# EAGLE design PRY397 (EAGLE 9.4.2)
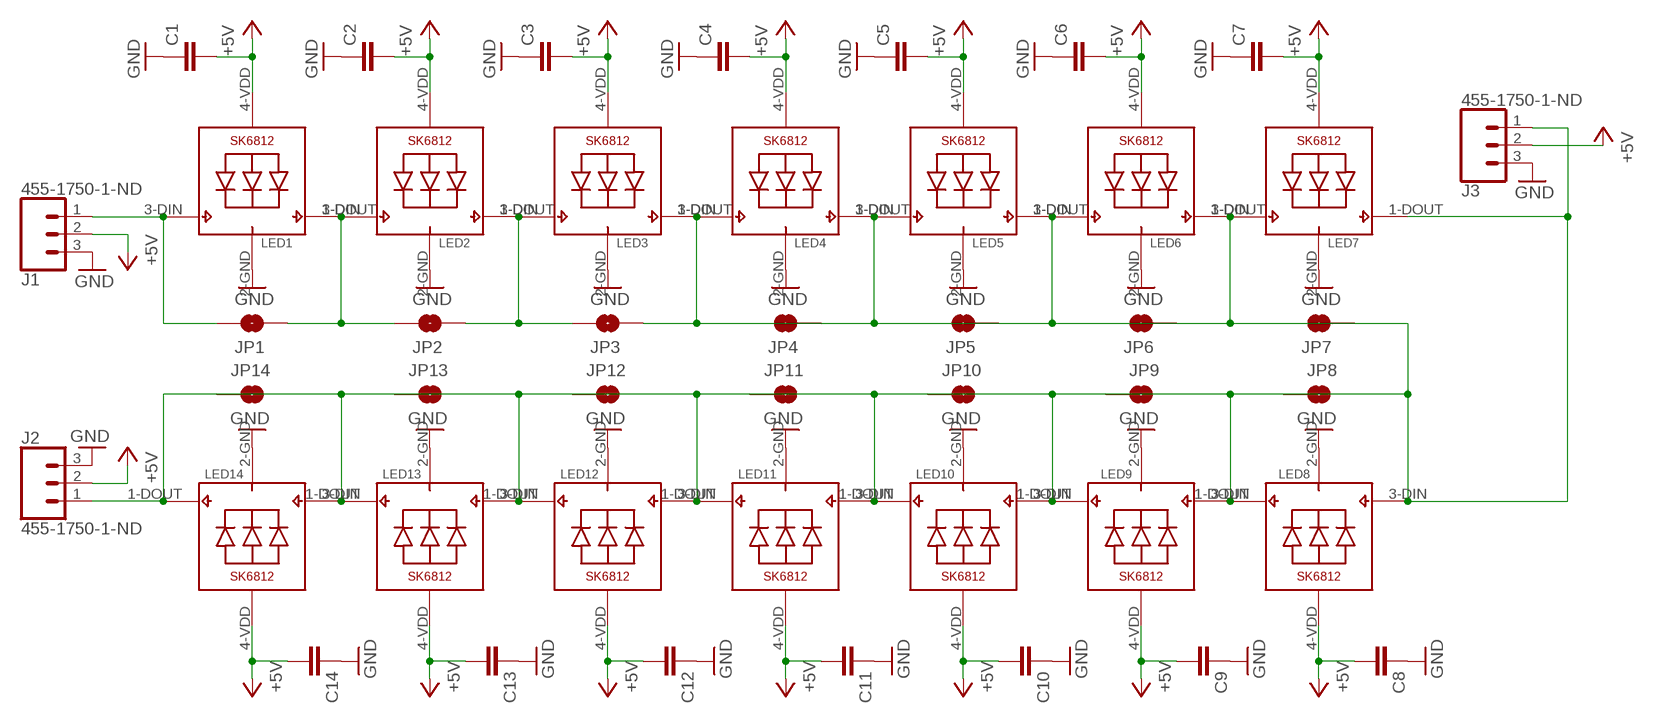
[diagram p0: schematic, sheet 1]

## Parts
C1  C-EUC1206  [C1206]
C2  C-EUC1206  [C1206]
C3  C-EUC1206  [C1206]
C4  C-EUC1206  [C1206]
C5  C-EUC1206  [C1206]
C6  C-EUC1206  [C1206]
C7  C-EUC1206  [C1206]
C8  C-EUC1206  [C1206]
C9  C-EUC1206  [C1206]
C10  C-EUC1206  [C1206]
C11  C-EUC1206  [C1206]
C12  C-EUC1206  [C1206]
C13  C-EUC1206  [C1206]
C14  C-EUC1206  [C1206]
J1  455-1750-1-ND  CONN_03  [1X03]
J2  455-1750-1-ND  CONN_03  [1X03]
J3  455-1750-1-ND  CONN_03LONGPADS  [1X03_LONGPADS]
JP1  JUMPER-SMT_2_NO_SILK  [SMT-JUMPER_2_NO_SILK]
JP2  JUMPER-SMT_2_NO_SILK  [SMT-JUMPER_2_NO_SILK]
JP3  JUMPER-SMT_2_NO_SILK  [SMT-JUMPER_2_NO_SILK]
JP4  JUMPER-SMT_2_NO_SILK  [SMT-JUMPER_2_NO_SILK]
JP5  JUMPER-SMT_2_NO_SILK  [SMT-JUMPER_2_NO_SILK]
JP6  JUMPER-SMT_2_NO_SILK  [SMT-JUMPER_2_NO_SILK]
JP7  JUMPER-SMT_2_NO_SILK  [SMT-JUMPER_2_NO_SILK]
JP8  JUMPER-SMT_2_NO_SILK  [SMT-JUMPER_2_NO_SILK]
JP9  JUMPER-SMT_2_NO_SILK  [SMT-JUMPER_2_NO_SILK]
JP10  JUMPER-SMT_2_NO_SILK  [SMT-JUMPER_2_NO_SILK]
JP11  JUMPER-SMT_2_NO_SILK  [SMT-JUMPER_2_NO_SILK]
JP12  JUMPER-SMT_2_NO_SILK  [SMT-JUMPER_2_NO_SILK]
JP13  JUMPER-SMT_2_NO_SILK  [SMT-JUMPER_2_NO_SILK]
JP14  JUMPER-SMT_2_NO_SILK  [SMT-JUMPER_2_NO_SILK]
LED1  SK6812_3535  [LED3535]
LED2  SK6812_3535  [LED3535]
LED3  SK6812_3535  [LED3535]
LED4  SK6812_3535  [LED3535]
LED5  SK6812_3535  [LED3535]
LED6  SK6812_3535  [LED3535]
LED7  SK6812_3535  [LED3535]
LED8  SK6812_3535  [LED3535]
LED9  SK6812_3535  [LED3535]
LED10  SK6812_3535  [LED3535]
LED11  SK6812_3535  [LED3535]
LED12  SK6812_3535  [LED3535]
LED13  SK6812_3535  [LED3535]
LED14  SK6812_3535  [LED3535]

## Nets
+5V: C1.2 C2.2 C3.2 C4.2 C5.2 C6.2 C7.2 C8.2 C9.2 C10.2 C11.2 C12.2 C13.2 C14.2 J1.2 J2.2 J3.2 LED1.4-VDD(VDD) LED2.4-VDD(VDD) LED3.4-VDD(VDD) LED4.4-VDD(VDD) LED5.4-VDD(VDD) LED6.4-VDD(VDD) LED7.4-VDD(VDD) LED8.4-VDD(VDD) LED9.4-VDD(VDD) LED10.4-VDD(VDD) LED11.4-VDD(VDD) LED12.4-VDD(VDD) LED13.4-VDD(VDD) LED14.4-VDD(VDD)
GND: C1.1 C2.1 C3.1 C4.1 C5.1 C6.1 C7.1 C8.1 C9.1 C10.1 C11.1 C12.1 C13.1 C14.1 J1.3 J2.3 J3.3 LED1.2-GND(GND) LED2.2-GND(GND) LED3.2-GND(GND) LED4.2-GND(GND) LED5.2-GND(GND) LED6.2-GND(GND) LED7.2-GND(GND) LED8.2-GND(GND) LED9.2-GND(GND) LED10.2-GND(GND) LED11.2-GND(GND) LED12.2-GND(GND) LED13.2-GND(GND) LED14.2-GND(GND)
N$1: JP1.2 JP2.1 LED1.1-DOUT(DO) LED2.3-DIN(DI)
N$2: JP2.2 JP3.1 LED2.1-DOUT(DO) LED3.3-DIN(DI)
N$3: JP3.2 JP4.2 LED3.1-DOUT(DO) LED4.3-DIN(DI)
N$4: JP4.1 JP5.2 LED4.1-DOUT(DO) LED5.3-DIN(DI)
N$5: JP5.1 JP6.2 LED5.1-DOUT(DO) LED6.3-DIN(DI)
N$6: JP6.1 JP7.2 LED6.1-DOUT(DO) LED7.3-DIN(DI)
N$7: JP8.1 JP9.2 LED8.1-DOUT(DO) LED9.3-DIN(DI)
N$8: JP9.1 JP10.2 LED9.1-DOUT(DO) LED10.3-DIN(DI)
N$9: JP10.1 JP11.2 LED10.1-DOUT(DO) LED11.3-DIN(DI)
N$10: JP11.1 JP12.2 LED11.1-DOUT(DO) LED12.3-DIN(DI)
N$11: JP12.1 JP13.2 LED12.1-DOUT(DO) LED13.3-DIN(DI)
N$12: JP13.1 JP14.2 LED13.1-DOUT(DO) LED14.3-DIN(DI)
N$13: J3.1 JP7.1 JP8.2 LED7.1-DOUT(DO) LED8.3-DIN(DI)
N$14: J1.1 JP1.1 LED1.3-DIN(DI)
N$15: J2.1 JP14.1 LED14.1-DOUT(DO)

## Library data of the parts
C1-C14 = rcl:C-EU: CAPACITOR, European symbol; SPICEPREFIX: C
J1 J2 = SparkFun-Connectors:CONN_03: Multi connection point. Often used as Generic Header-pin footprint for 0.1 inch spaced/style header connections On any of the 0.1 inch spaced packages, you can populate with these: Break Away Headers - Straight <https://www.sparkfun.com/products/116> (PRT-00116) Break Away Male Headers - Right Angle <https://www.sparkfun.com/products/553> (PRT-00553) Female Headers <https://www.sparkfun.com/products/115> (PRT-00115) Break Away Headers - Machine Pin <https://www.sparkfun.com/products/117> (PRT-00117) Break Away Female Headers - Swiss Machine Pin <https://www.sparkfun.com/products/743> (PRT-00743) Stackable Header - 3 Pin (Female, 0.1") <https://www.sparkfun.com/products/13875> (PRT-13875) For SCREWTERMINALS and SPRING TERMINALS visit here: Screw Terimnals on SparkFun.com <https://www.sparkfun.com/search/results?term=Screw+Terminals> (5mm/3.5mm/2.54mm spacing) This device is also useful as a general connection point to wire up your design to another part of your project. Our various solder wires solder well into these plated through hole pads. Hook-Up Wire - Assortment (Stranded, 22 AWG) <https://www.sparkfun.com/products/11375> (PRT-11375) Hook-Up Wire - Assortment (Solid Core, 22 AWG) <https://www.sparkfun.com/products/11367> (PRT-11367) View the entire wire category on our website here <https://www.sparkfun.com/categories/141> Special notes: Molex polarized connector foot print use with SKU : PRT-08232 with associated crimp pins and housings.; PROD_ID: XXX-00000
J3 = SparkFun-Connectors:CONN_03: Multi connection point. Often used as Generic Header-pin footprint for 0.1 inch spaced/style header connections On any of the 0.1 inch spaced packages, you can populate with these: Break Away Headers - Straight <https://www.sparkfun.com/products/116> (PRT-00116) Break Away Male Headers - Right Angle <https://www.sparkfun.com/products/553> (PRT-00553) Female Headers <https://www.sparkfun.com/products/115> (PRT-00115) Break Away Headers - Machine Pin <https://www.sparkfun.com/products/117> (PRT-00117) Break Away Female Headers - Swiss Machine Pin <https://www.sparkfun.com/products/743> (PRT-00743) Stackable Header - 3 Pin (Female, 0.1") <https://www.sparkfun.com/products/13875> (PRT-13875) For SCREWTERMINALS and SPRING TERMINALS visit here: Screw Terimnals on SparkFun.com <https://www.sparkfun.com/search/results?term=Screw+Terminals> (5mm/3.5mm/2.54mm spacing) This device is also useful as a general connection point to wire up your design to another part of your project. Our various solder wires solder well into these plated through hole pads. Hook-Up Wire - Assortment (Stranded, 22 AWG) <https://www.sparkfun.com/products/11375> (PRT-11375) Hook-Up Wire - Assortment (Solid Core, 22 AWG) <https://www.sparkfun.com/products/11367> (PRT-11367) View the entire wire category on our website here <https://www.sparkfun.com/categories/141> Special notes: Molex polarized connector foot print use with SKU : PRT-08232 with associated crimp pins and housings.
JP1-JP14 = SparkFun-Jumpers:JUMPER-SMT_2_NO: Normally open jumper This jumper has two pads in close proximity to each other. Apply solder to close the connection. Round pads are easier to solder for beginners, but are a lot larger. SparkFun Product that uses the round pads: SparkFun EL Sequencer <https://www.sparkfun.com/products/12781>
LED1-LED14 = SK6812:SK6812

## Board
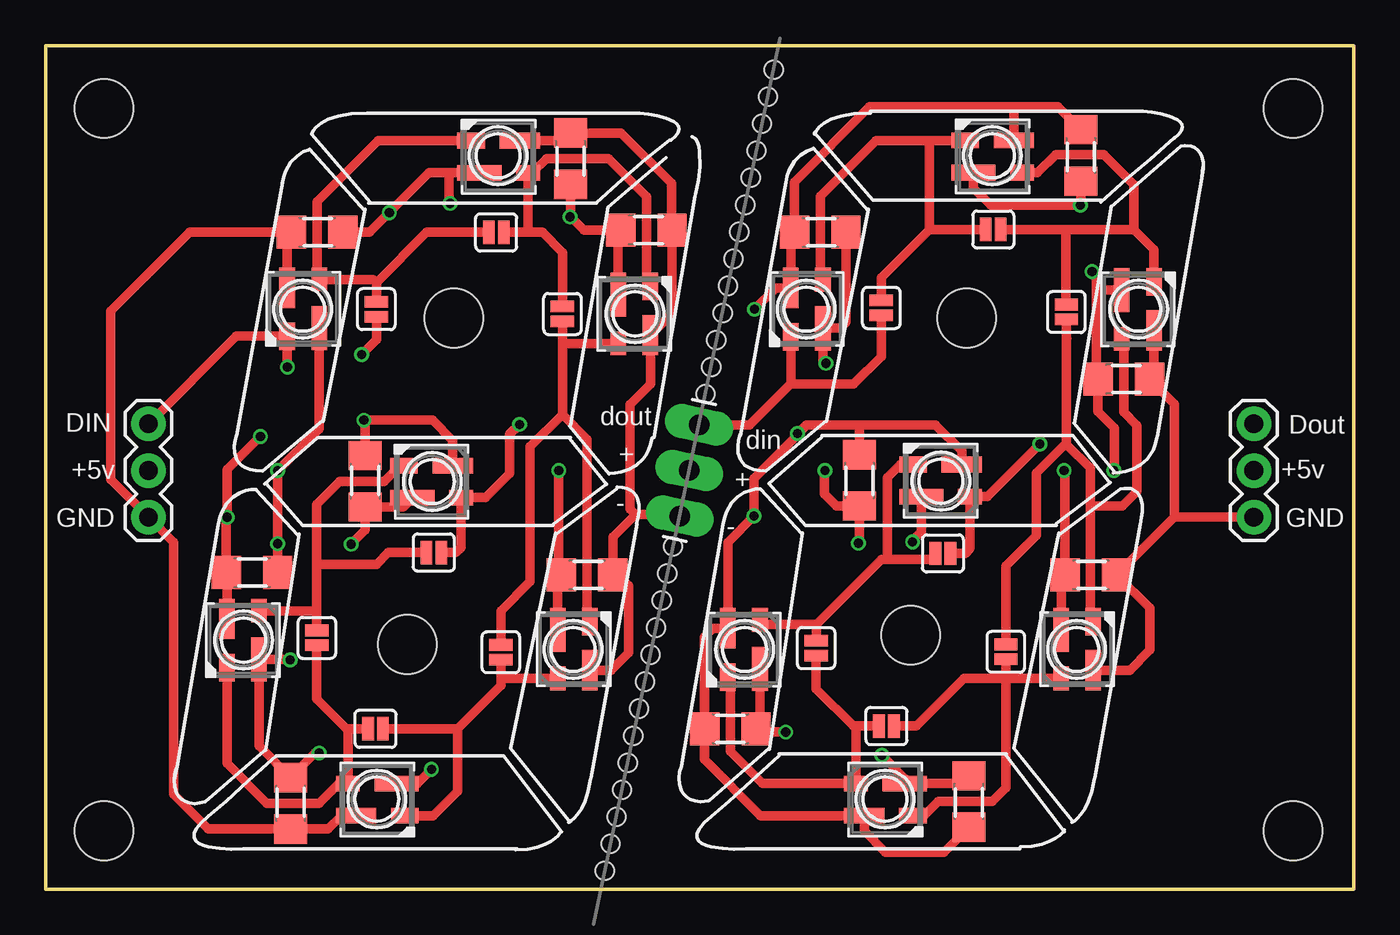
[diagram p1: board, top side]
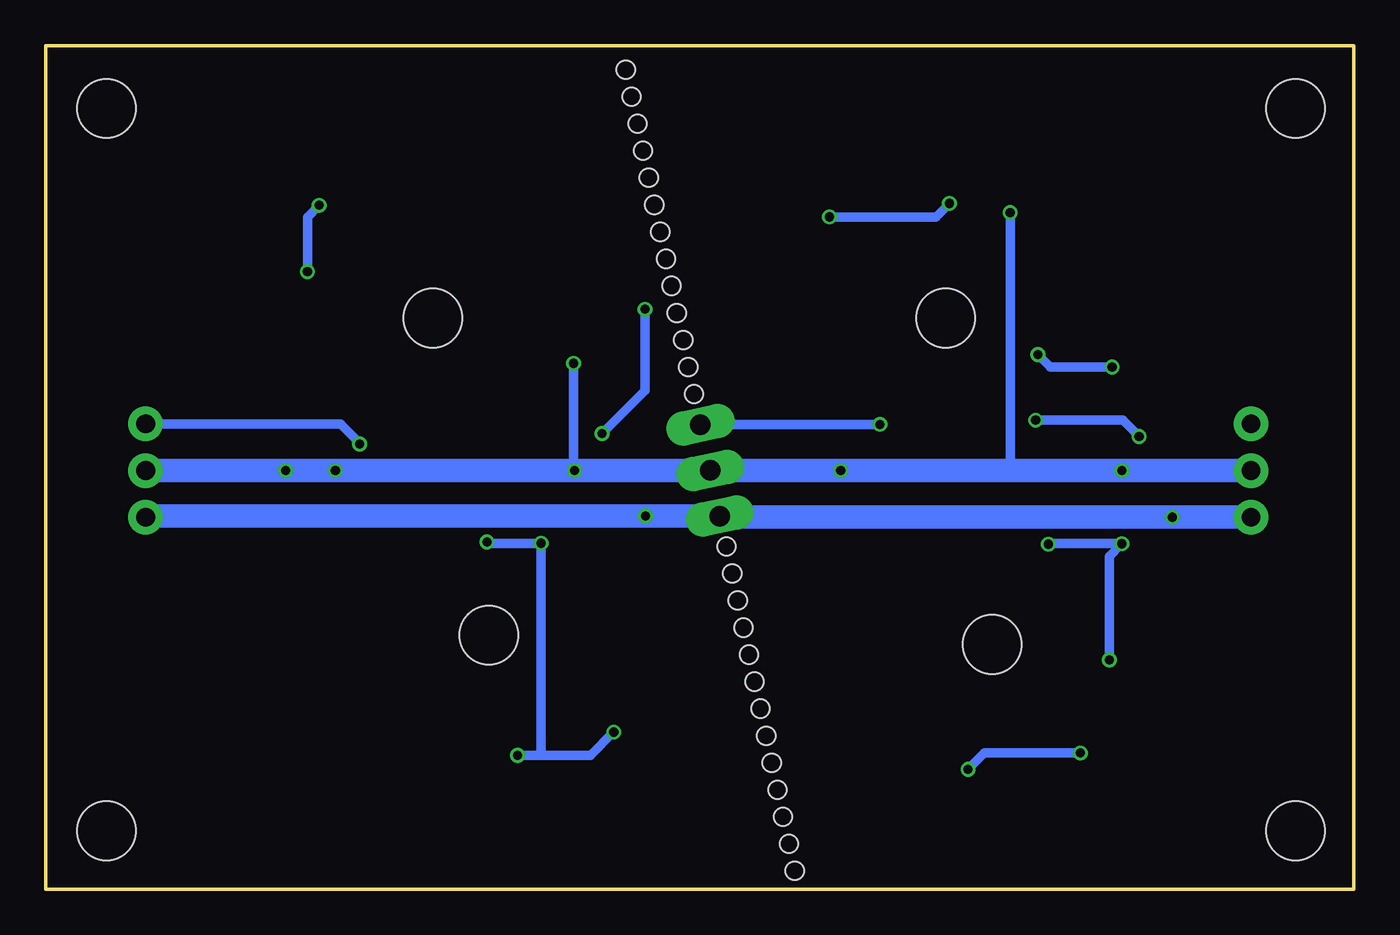
[diagram p2: board, bottom side, seen from below]

Size 71.25 x 45.95 mm. Coordinates in mm from the lower left corner, seen from the top.
Outline: 0,0 71.25,0 71.25,45.95 0,45.95 0,0
Copper layers (1*16): Top 0.035mm / dielectric 1.5mm / Bottom 0.035mm
Design rules "_xircuitos.mx_2L_DRC": minimum track width 6mil, minimum drill 12mil, track to track 6mil, track to pad 6mil, pad to pad 6mil, via to via 6mil, smd to smd 0mil, copper to edge 10mil, drill to drill 12mil, minimum pad ring 10mil, minimum via ring 6mil, stop-mask expansion 2mil, vias tented up to drill 100mil, thermal gap 10mil
Holes 3.2 mm at 3.17,42.55 67.94,42.55 67.94,3.17 3.17,3.17 22.23,31.11 19.68,13.34 47.12,13.84 50.16,31.11
Holes 1 mm at 34.16,18.67 33.86,17.2 33.55,15.72 33.25,14.25 32.94,12.78 32.64,11.3 32.31,9.83 32,8.36 31.7,6.88 31.39,5.41 31.09,3.94 30.76,2.46 30.45,0.99 35.94,26.97 36.25,28.45 36.53,29.92 36.88,31.39 37.16,32.87 37.47,34.34 37.77,35.81 38.1,37.29 38.4,38.76 38.71,40.23 39.01,41.71 39.34,43.18 39.65,44.65

### Footprints (pad centres in the part's own frame; a part is rotated, then mirrored left to right if it is on the bottom)
C1206 = smd 1.6 x 1.8: 1 -1.4,0; 2 1.4,0
1X03 = drill 1.016 pad 1.88: 1 0,0; 2 2.54,0; 3 5.08,0
1X03_LONGPADS = drill 1.118 pad 1.88 long: 1 0,0; 2 2.54,0; 3 5.08,0
SMT-JUMPER_2_NO_SILK = smd 0.635 x 1.27: 1 -0.406,0; 2 0.406,0
LED3535 = smd 1.3 x 0.85: 1-DOUT 1.6,-0.875 | smd 2.2 x 0.85: 2-GND 1.15,0.875 | smd 1.5 x 0.85: 3-DIN -1.5,0.875 | smd 2.4 x 0.85: 4-VDD -1.05,-0.875

### Placement (x,y rotation side)
C1  14.78,35.79 0 top
C2  28.57,39.8 270 top
C3  32.72,35.92 180 top
C4  29.49,17.12 180 top
C5  13.34,4.67 90 top
C6  11.23,17.25 0 top
C7  17.4,22.23 270 top
C8  42.19,35.79 0 top
C9  56.39,39.98 270 top
C10  58.72,27.79 180 top
C11  56.92,17.12 180 top
C12  50.29,4.78 90 top
C13  37.29,8.74 0 top
C14  44.32,22.28 270 top
J1  5.59,25.35 270 top
J2  65.81,25.35 270 top
J3  35.59,25.3 258 top
JP1  18.01,31.6 90 top
JP2  24.54,35.79 0 top
JP3  28.14,31.34 270 top
JP4  24.79,12.9 90 top
JP5  17.96,8.74 0 top
JP6  14.76,13.69 270 top
JP7  21.13,18.34 180 top
JP8  45.52,31.67 270 top
JP9  51.61,35.94 180 top
JP10  55.6,31.45 90 top
JP11  52.3,12.93 90 top
JP12  45.8,8.89 0 top
JP13  41.96,13.13 270 top
JP14  48.87,18.29 180 top
LED1  14.02,31.62 90 top
LED2  24.67,39.91 0 top
LED3  32.06,31.34 270 top
LED4  28.76,13.08 270 top
LED5  18.05,4.87 180 top
LED6  10.74,13.57 90 top
LED7  21.01,22.2 0 top
LED8  41.46,31.61 90 top
LED9  51.59,39.92 0 top
LED10  59.49,31.59 270 top
LED11  56.19,13.08 270 top
LED12  45.74,4.88 180 top
LED13  38.03,13.06 90 top
LED14  48.75,22.26 0 top

### Tracks (layer width: path | path; a pad name or v marks a point on that pad's centre or on a via)
+5V  (via drill 0.5)
  Top 0.508: C6.2 v12.63,18.82 12.63,20.83 | 12.63,20.83 v12.63,22.81 | v12.63,22.81 v12.62,22.81 | 12.63,20.82 12.63,20.83 | LED4.4-VDD 27.88,16.91 C4.2 27.94,17.27 v27.94,22.81 | v55.47,22.81 55.52,22.77 C11.2 55.31,16.91 LED11.4-VDD | C12.2 49.87,5.76 LED12.4-VDD 46.79,6.04 v45.54,7.29 | LED1.4-VDD 14.89,25.07 v12.63,22.81 | LED7.4-VDD 19.46,20.82 C7.2 17.4,19.56 v16.64,18.8 | 21.97,39.03 20.87,39.03 v18.71,36.87 17.63,35.79 C1.2 | 21.97,39.03 LED2.4-VDD | 28.83,38.4 C2.2 28.57,36.65 | LED3.4-VDD 31.18,35.78 C3.2 29.31,35.92 28.57,36.65 | 28.57,36.65 v28.55,36.63 | v22.02,37.36 21.97,37.41 21.97,39.03 | v13.31,12.5 13.29,12.52 LED6.4-VDD 11.62,7.79 C5.2 14.68,7.42 v14.88,7.42 | v21.01,6.53 20.23,5.75 LED5.4-VDD | LED13.4-VDD 38.9,8.95 C13.2 38.87,8.56 v40.31,8.56 | v42.44,22.81 42.42,22.79 42.42,21.54 43.08,20.88 C14.2 44.32,18.9 v44.27,18.85 | LED14.4-VDD 47.7,19.48 47.22,19 v47.22,18.92 | C10.2 57.33,26.01 58.22,25.12 58.22,22.84 v58.19,22.81 | v42.49,28.65 42.34,28.81 LED8.4-VDD 42.36,30.58 43.28,30.58 43.59,30.89 C8.2 43.64,35.74 | C9.2 56.39,37.29 v56.36,37.26 51.49,37.26 50.54,38.21 LED9.4-VDD | C10.2 57,28.11 | C10.2 57.23,27.89 57.23,32.66 | v57,33.66 57.23,33.43 57.23,32.66 | LED10.4-VDD 57.25,32.64 57.23,32.66
  Bottom 0.508: v28.55,36.63 22.76,36.63 v22.02,37.36 | v18.71,36.87 18.71,22.82 18.72,22.81 | v13.31,12.5 13.31,18.14 v12.63,18.82 12.6,18.85 16.56,18.85 16.61,18.8 v16.64,18.8 | v14.88,7.42 20.12,7.42 v21.01,6.53 | v42.49,28.65 42.49,22.86 v42.44,22.81 | v45.54,7.29 44.25,7.29 | 44.25,7.29 41.58,7.29 v40.31,8.56 | 44.25,7.29 44.27,7.32 v44.27,18.85 47.07,18.85 47.14,18.92 v47.22,18.92 | v57,33.66 57,36.63 v56.36,37.26
  Bottom 1.016: 35.26,22.81 35.51,22.55 35.25,22.81 J3.2 | J2.2
  Bottom 1.27: J1.2 v12.62,22.81 18.72,22.81 v27.94,22.81 35.26,22.81 | J3.2 v42.44,22.81 v55.47,22.81 v58.19,22.81 J2.2
GND  (via drill 0.5)
  Top 0.508: LED6.2-GND 9.87,17.21 C6.1 9.83,20.21 v9.88,20.27 9.88,22.86 v11.68,24.66 | C4.1 30.89,17.4 | 30.89,17.4 30.89,19.18 32.13,20.42 | 32.13,20.42 34.44,20.42 J3.3 | C11.1 58.33,17.13 | 58.33,17.13 61.47,20.27 | 61.47,20.27 J2.3 | LED10.2-GND 60.37,28.03 C10.1 61.47,26.44 61.47,20.27 | LED11.2-GND 59.04,11.93 60.15,13.03 60.15,15.32 58.33,17.13 | C12.1 48.92,2.01 45.74,2.01 44.59,3.17 LED12.2-GND 38.94,4.01 35.89,7.06 C13.1 35.89,13.74 36.36,14.21 LED13.2-GND 37.15,18.9 v38.58,20.33 38.58,22.38 41.02,24.82 v40.95,24.82 41.43,25.3 44.32,25.3 C14.1 44.32,25.3 48.46,25.3 49.9,23.86 LED14.2-GND | LED1.2-GND 13.14,35.55 C1.1 7.82,35.79 3.53,31.5 3.53,22.33 J1.3 6.96,18.9 6.96,5.16 8.84,3.27 C5.1 15.39,3.27 16.11,4 LED5.2-GND | LED2.2-GND 28.16,40.78 C2.1 31.34,41.2 34.09,38.46 34.09,35.94 C3.1 34.12,31.37 LED3.2-GND 32.93,27.52 31.83,26.42 31.83,20.73 32.13,20.42 | C7.1 17.4,25.48 v17.32,25.55 21.06,25.55 22.16,24.44 LED7.2-GND | LED4.2-GND 30.8,11.93 31.75,12.88 31.75,16.54 30.89,17.4 | C9.1 55.15,42.62 52.7,42.62 | 52.7,42.62 44.88,42.62 40.79,38.53 C8.1 40.59,35.59 LED8.2-GND 39.77,32.76 v38.61,31.6 | LED9.2-GND 52.74,42.59 52.7,42.62
  Bottom 0.508: v11.68,24.66 12.57,25.55 v17.32,25.55 | v38.61,31.6 38.61,27.16 v40.95,24.82
  Bottom 1.016: 34.47,20.27 J3.3 | 65.75,20.33 J2.3
  Bottom 1.27: J1.3 v9.88,20.27 34.47,20.27 | J3.3 v38.58,20.33 65.75,20.33
N$1
  Top 0.508: JP1.2 18.01,33.05 | JP2.1 20.75,35.79 18.01,33.05 | 18.01,33.05 17.83,33.22 LED1.1-DOUT 14.78,33.33 14.78,37.47 18.1,40.78 20.94,40.78 | LED2.3-DIN 20.94,40.78 | 20.94,40.78 20.93,40.79
N$2
  Top 0.508: JP2.2 26.34,35.79 | 26.34,35.79 27.05,35.79 28.14,34.7 28.14,34.16 JP3.1 | 26.34,35.79 26.27,35.86 LED2.1-DOUT 26.49,39.03 27.26,39.8 30.66,39.8 32.72,37.74 32.72,33.06 LED3.3-DIN
N$3
  Top 0.508: JP4.2 24.79,15.16 26.39,16.76 26.39,24.11 28.14,25.86 | JP3.2 28.14,29.72 | 28.14,29.72 28.14,25.86 | LED3.1-DOUT 28.17,29.74 28.14,29.72 | LED4.3-DIN 29.49,14.72 29.49,24.51 28.14,25.86
N$4
  Top 0.508: JP5.2 22.43,8.74 | 24.79,11.4 24.79,11.1 22.43,8.74 | 24.79,11.4 JP4.1 | LED5.3-DIN 21.09,4 22.43,5.33 22.43,8.74 | LED4.1-DOUT 24.86,11.48 24.79,11.4
N$5
  Top 0.508: JP6.2 14.76,10.36 16.38,8.74 | 16.38,8.74 JP5.1 | 16.38,8.74 16.45,8.67 LED5.1-DOUT 15.96,5.75 14.88,4.67 12.04,4.67 9.87,6.85 LED6.3-DIN
N$6
  Top 0.508: LED7.3-DIN 19.29,23.08 18.41,22.2 16,22.2 14.76,20.95 14.76,17.7 | 14.76,17.7 14.76,15.11 | 14.76,15.11 JP6.1 | JP7.2 18.64,18.34 18.01,17.7 14.76,17.7 | LED6.1-DOUT 14.7,15.17 14.76,15.11
N$7
  Top 0.508: JP9.2 49.38,35.94 48.13,35.94 | LED9.3-DIN 49,40.79 48.11,40.79 | LED8.1-DOUT 42.19,33.36 42.19,37.77 45.21,40.79 48.11,40.79 | 48.11,40.79 48.13,40.77 48.13,35.94 | JP8.1 45.52,33.33 48.13,35.94
N$8
  Top 0.508: JP9.1 53.72,35.94 55.6,35.94 | JP10.2 55.58,31.88 55.58,35.92 55.6,35.94 | LED10.3-DIN 60.37,34.86 59.28,35.94 | 59.28,35.94 55.6,35.94 | LED9.1-DOUT 54.03,39.04 55.02,40.03 57.63,40.03 59.28,38.38 59.28,35.94
N$9
  Top 0.508: 52.25,13.39 JP11.2 52.3,17.6 53.98,19.28 53.98,22.68 55.6,24.31 55.6,25.81 | LED11.3-DIN 56.9,14.75 56.9,20.88 | 56.9,20.88 56.9,22.94 55.6,24.23 55.6,25.81 | JP10.1 55.6,29.97 | 55.6,29.97 55.6,25.81 | 55.62,29.99 55.6,29.97 | LED10.1-DOUT 58.73,29.88 58.73,25.98 59.44,25.27 59.44,21.67 58.65,20.88 56.9,20.88
N$10
  Top 0.508: LED12.3-DIN 47.85,4.01 48.62,4.78 51.56,4.78 52.3,5.51 52.3,11.48 53.34,11.48 | JP12.2 47.42,8.89 50.01,11.48 52.35,11.48 | 53.34,11.48 LED11.1-DOUT | 53.34,11.48 52.35,11.48 | JP11.1 52.3,11.53 52.35,11.48
N$11
  Top 0.508: JP13.2 41.96,10.92 43.99,8.89 44.22,8.89 | 44.22,8.89 JP12.1 | 44.22,8.89 44.14,8.8 LED12.1-DOUT 39.05,5.76 37.29,7.52 37.29,11.43 LED13.3-DIN
N$12
  Top 0.508: 41.99,14.43 41.99,13.56 JP13.1 | LED14.3-DIN 46.55,23.14 45.85,22.43 45.85,18.01 45.8,17.96 | 41.99,14.43 45.52,17.96 45.8,17.96 | 45.8,17.96 48.46,17.96 JP14.2 | LED13.1-DOUT 39.14,14.43 41.99,14.43
N$13  (via drill 0.5)
  Top 0.508: JP7.1 22.33,18.34 22.61,18.63 LED7.1-DOUT 23.94,21.33 25.27,22.66 25.27,24.79 v25.81,25.32 | J3.1 38.33,25.3 40.59,27.56 | 40.59,27.56 LED8.3-DIN | JP8.2 45.52,29.03 43.99,27.51 40.64,27.51 40.59,27.56
  Bottom 0.508: v25.81,25.32 35.56,25.32 J3.1
N$14  (via drill 0.5)
  Top 0.508: J1.1 10.36,30.12 LED1.3-DIN 13.16,30.11 v13.16,28.45 | JP1.1 18.01,29.95 v17.2,29.13
  Bottom 0.508: v17.2,29.13 16.51,28.45 v13.16,28.45
N$15  (via drill 0.5)
  Top 0.508: JP14.1 50.09,18.29 50.35,18.55 LED14.1-DOUT 51.28,21.39 v54.15,24.26
  Bottom 0.508: J2.1 55.19,25.35 54.15,24.31 v54.15,24.26

### Text on the board
tPlace: DIN | dout | Dout | din | + | +5v | + | +5v | GND | - | GND | -